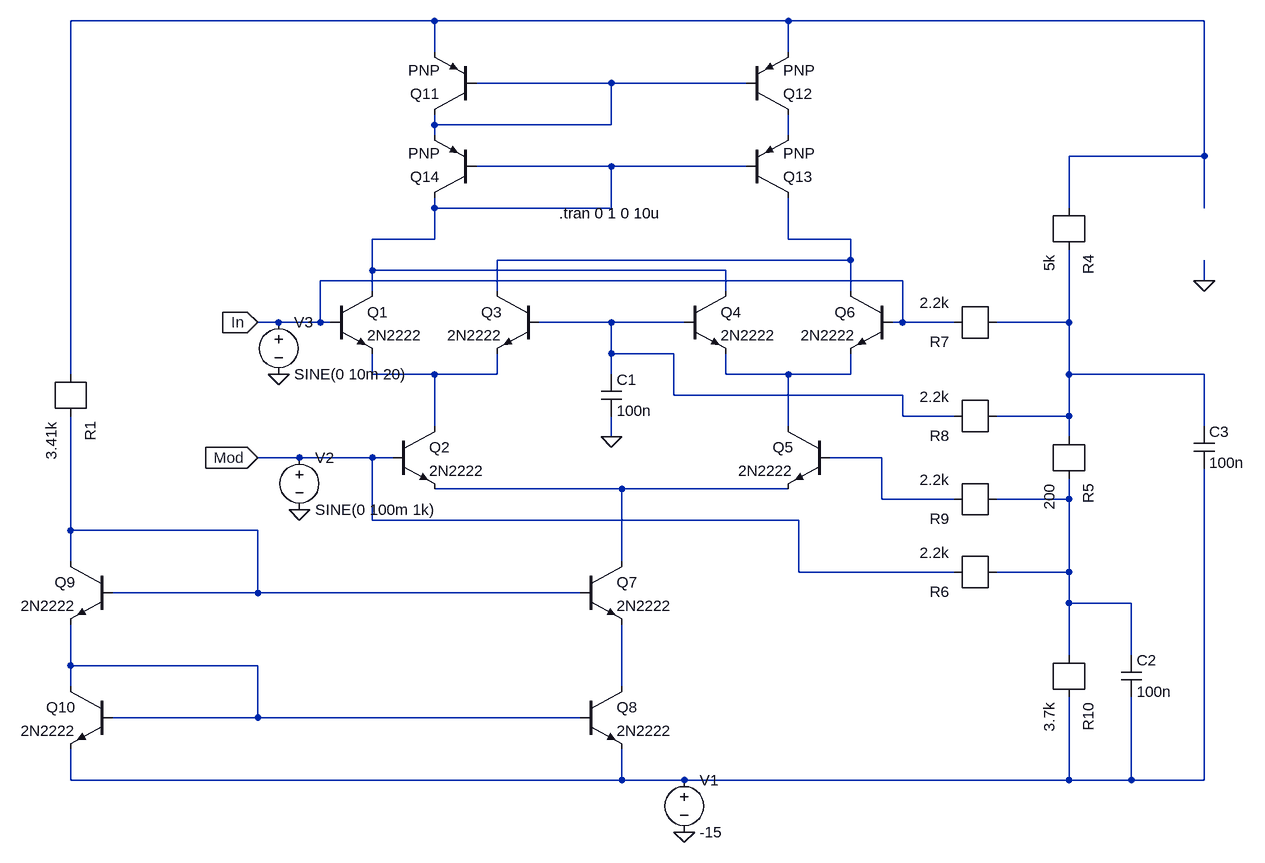
[diagram p0: schematic gilbert_cell.asc]
gilbert_cell.asc, the LTspice schematic file:
Version 4
SHEET 1 1220 944
WIRE -32 -320 -592 -320
WIRE 512 -320 -32 -320
WIRE 1152 -320 512 -320
WIRE -32 -272 -32 -320
WIRE 512 -272 512 -320
WIRE 240 -224 32 -224
WIRE 448 -224 240 -224
WIRE -32 -160 -32 -176
WIRE 240 -160 240 -224
WIRE 240 -160 -32 -160
WIRE -32 -144 -32 -160
WIRE 512 -144 512 -176
WIRE 1152 -112 1152 -320
WIRE 1152 -112 944 -112
WIRE 240 -96 32 -96
WIRE 448 -96 240 -96
WIRE -32 -32 -32 -48
WIRE 240 -32 240 -96
WIRE 240 -32 -32 -32
WIRE 944 -32 944 -112
WIRE 1152 -32 1152 -112
WIRE -32 16 -32 -32
WIRE -32 16 -128 16
WIRE 512 16 512 -48
WIRE 608 16 512 16
WIRE 80 48 64 48
WIRE 400 48 80 48
WIRE 608 48 608 16
WIRE 608 48 400 48
WIRE -128 64 -128 16
WIRE 416 64 -128 64
WIRE 688 80 -208 80
WIRE 1152 80 1152 48
WIRE -208 96 -208 80
WIRE -128 96 -128 64
WIRE 64 96 64 48
WIRE 416 96 416 64
WIRE 608 96 608 48
WIRE 688 96 688 80
WIRE -272 144 -304 144
WIRE -208 144 -208 96
WIRE -208 144 -272 144
WIRE -192 144 -208 144
WIRE 240 144 128 144
WIRE 352 144 240 144
WIRE 688 144 688 96
WIRE 688 144 672 144
WIRE 768 144 688 144
WIRE 944 144 944 32
WIRE 944 144 832 144
WIRE 240 192 240 144
WIRE 336 192 240 192
WIRE -592 224 -592 -320
WIRE -128 224 -128 192
WIRE -32 224 -128 224
WIRE 64 224 64 192
WIRE 64 224 -32 224
WIRE 240 224 240 192
WIRE 416 224 416 192
WIRE 512 224 416 224
WIRE 608 224 608 192
WIRE 608 224 512 224
WIRE 944 224 944 144
WIRE 1152 224 944 224
WIRE 336 256 336 192
WIRE 528 256 336 256
WIRE 688 256 528 256
WIRE 688 288 688 256
WIRE 768 288 688 288
WIRE 944 288 944 224
WIRE 944 288 832 288
WIRE -32 304 -32 224
WIRE 512 304 512 224
WIRE 1152 304 1152 224
WIRE 240 320 240 288
WIRE 944 320 944 288
WIRE -240 352 -304 352
WIRE -128 352 -240 352
WIRE -96 352 -128 352
WIRE 656 352 576 352
WIRE 256 400 -32 400
WIRE 512 400 256 400
WIRE 656 416 656 352
WIRE 768 416 656 416
WIRE 944 416 944 384
WIRE 944 416 832 416
WIRE -128 448 -128 352
WIRE 528 448 -128 448
WIRE -592 464 -592 288
WIRE -576 464 -592 464
WIRE -304 464 -576 464
WIRE -592 512 -592 464
WIRE 256 512 256 400
WIRE 528 528 528 448
WIRE 768 528 528 528
WIRE 944 528 944 416
WIRE 944 528 832 528
WIRE -304 560 -304 464
WIRE -304 560 -528 560
WIRE 192 560 -304 560
WIRE 944 576 944 528
WIRE 1040 576 944 576
WIRE 944 656 944 576
WIRE 1040 656 1040 576
WIRE -592 672 -592 608
WIRE -304 672 -592 672
WIRE -592 704 -592 672
WIRE 256 704 256 608
WIRE -304 752 -304 672
WIRE -304 752 -528 752
WIRE 192 752 -304 752
WIRE -592 848 -592 800
WIRE 256 848 256 800
WIRE 256 848 -592 848
WIRE 352 848 256 848
WIRE 944 848 944 720
WIRE 944 848 352 848
WIRE 1040 848 1040 720
WIRE 1040 848 944 848
WIRE 1152 848 1152 368
WIRE 1152 848 1040 848
FLAG 240 320 0
FLAG 1152 80 0
FLAG -304 144 In
IOPIN -304 144 In
FLAG -304 352 Mod
IOPIN -304 352 In
FLAG -272 224 0
FLAG -240 432 0
FLAG 352 928 0
SYMBOL npn -192 96 R0
SYMATTR InstName Q1
SYMATTR Value 2N2222
SYMBOL npn -96 304 R0
SYMATTR InstName Q2
SYMATTR Value 2N2222
SYMBOL npn 128 96 M0
SYMATTR InstName Q3
SYMATTR Value 2N2222
SYMBOL npn 352 96 R0
SYMATTR InstName Q4
SYMATTR Value 2N2222
SYMBOL npn 576 304 M0
SYMATTR InstName Q5
SYMATTR Value 2N2222
SYMBOL npn 672 96 M0
SYMATTR InstName Q6
SYMATTR Value 2N2222
SYMBOL npn 192 512 R0
SYMATTR InstName Q7
SYMATTR Value 2N2222
SYMBOL npn 192 704 R0
SYMATTR InstName Q8
SYMATTR Value 2N2222
SYMBOL npn -528 512 M0
SYMATTR InstName Q9
SYMATTR Value 2N2222
SYMBOL npn -528 704 M0
SYMATTR InstName Q10
SYMATTR Value 2N2222
SYMBOL r -592 224 R90
SYMATTR InstName R1
SYMATTR Value 3.41k
SYMBOL cap 224 224 R0
SYMATTR InstName C1
SYMATTR Value 100n
SYMBOL r 944 -32 R90
SYMATTR InstName R4
SYMATTR Value 5k
SYMBOL r 944 320 R90
SYMATTR InstName R5
SYMATTR Value 200
SYMBOL r 832 528 R180
SYMATTR InstName R6
SYMATTR Value 2.2k
SYMBOL r 832 144 R180
SYMATTR InstName R7
SYMATTR Value 2.2k
SYMBOL r 832 288 R180
SYMATTR InstName R8
SYMATTR Value 2.2k
SYMBOL r 832 416 R180
SYMATTR InstName R9
SYMATTR Value 2.2k
SYMBOL r 944 656 R90
SYMATTR InstName R10
SYMATTR Value 3.7k
SYMBOL cap 1024 656 R0
SYMATTR InstName C2
SYMATTR Value 100n
SYMBOL cap 1136 304 R0
SYMATTR InstName C3
SYMATTR Value 100n
SYMBOL voltage 352 832 R0
SYMATTR InstName V1
SYMATTR Value -15
SYMBOL voltage -240 336 R0
SYMATTR InstName V2
SYMATTR Value SINE(0 100m 1k)
SYMATTR Value2 AC 1
SYMBOL voltage -272 128 R0
SYMATTR InstName V3
SYMATTR Value SINE(0 10m 20)
SYMATTR Value2 AC 1
SYMBOL pnp 32 -176 R180
SYMATTR InstName Q11
SYMBOL pnp 448 -176 M180
SYMATTR InstName Q12
SYMBOL pnp 448 -48 M180
SYMATTR InstName Q13
SYMBOL pnp 32 -48 R180
SYMATTR InstName Q14
TEXT 160 -24 Left 2 !.tran 0 1 0 10u

The netlist it stands for:
* gilbert_cell.asc
Q1 N004 In N008 0 2N2222
Q2 N008 Mod N011 0 2N2222
Q3 N005 N006 N008 0 2N2222
Q4 N004 N006 N009 0 2N2222
Q5 N009 N010 N011 0 2N2222
Q6 N005 In N009 0 2N2222
Q7 N011 N013 N015 0 2N2222
Q8 N015 N014 N016 0 2N2222
Q9 N013 N013 N014 0 2N2222
Q10 N014 N014 N016 0 2N2222
R1 N013 N001 3.41k
C1 N006 0 100n
R4 N007 N001 5k
R5 N012 N007 200
R6 Mod N012 2.2k
R7 In N007 2.2k
R8 N006 N007 2.2k
R9 N010 N012 2.2k
R10 N016 N012 3.7k
C2 N012 N016 100n
C3 N007 N016 100n
V1 N016 0 -15
V2 Mod 0 SINE(0 100m 1k) AC 1
V3 In 0 SINE(0 10m 20) AC 1
Q11 N002 N002 N001 0 PNP
Q12 N003 N002 N001 0 PNP
Q13 N005 N004 N003 0 PNP
Q14 N004 N004 N002 0 PNP
.model NPN NPN
.model PNP PNP
.lib standard.bjt
.tran 0 1 0 10u
.backanno
.end